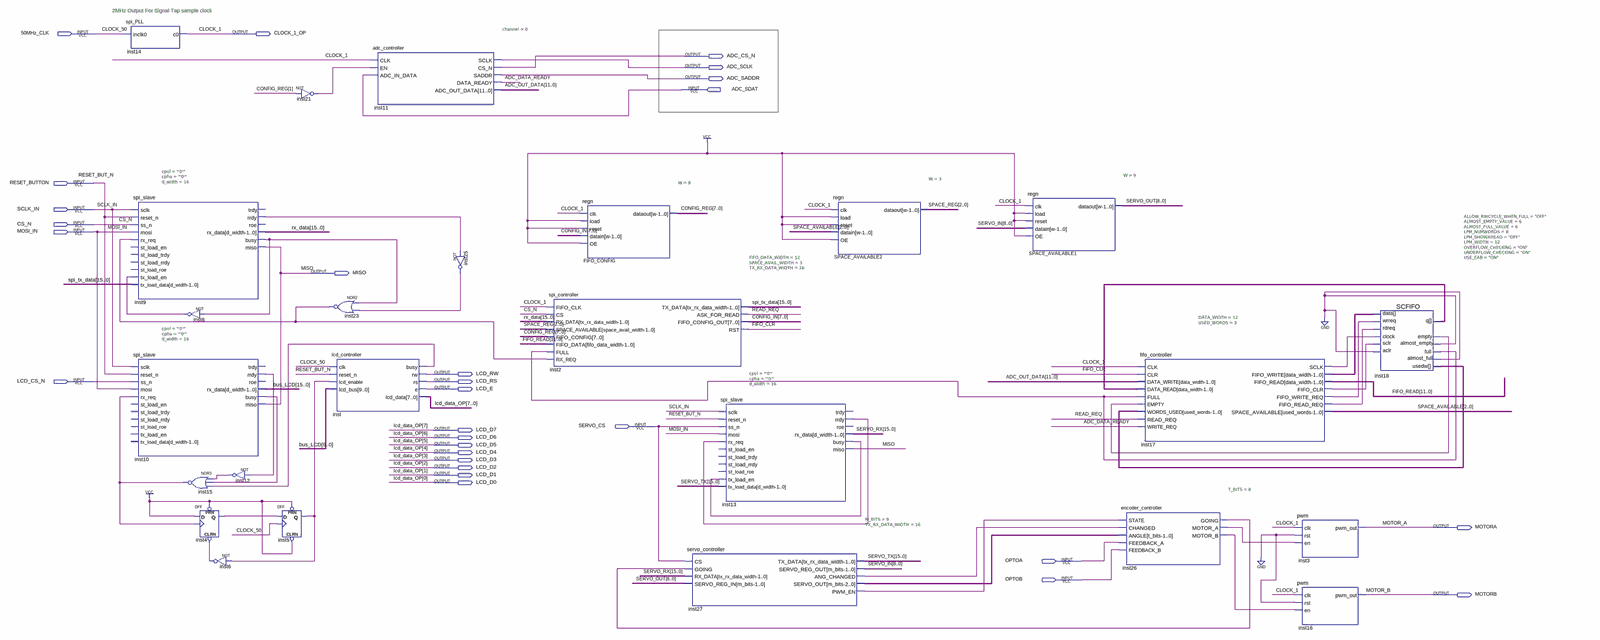
[diagram p0: schematic sheet, whole]
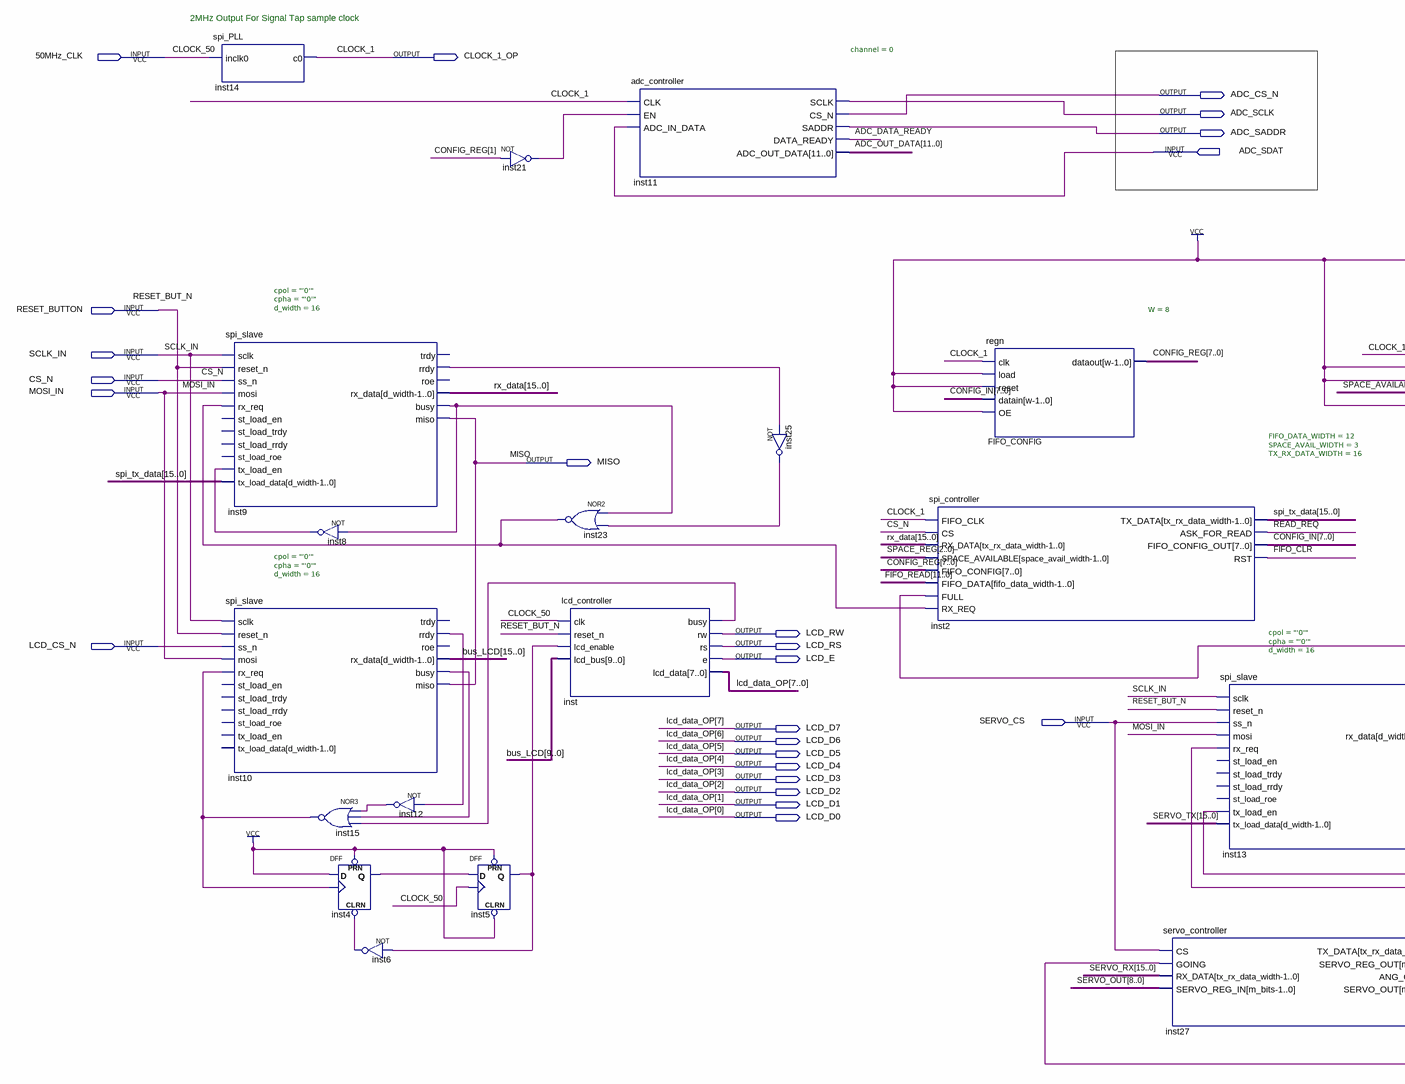
[diagram p1: schematic sheet, left part]
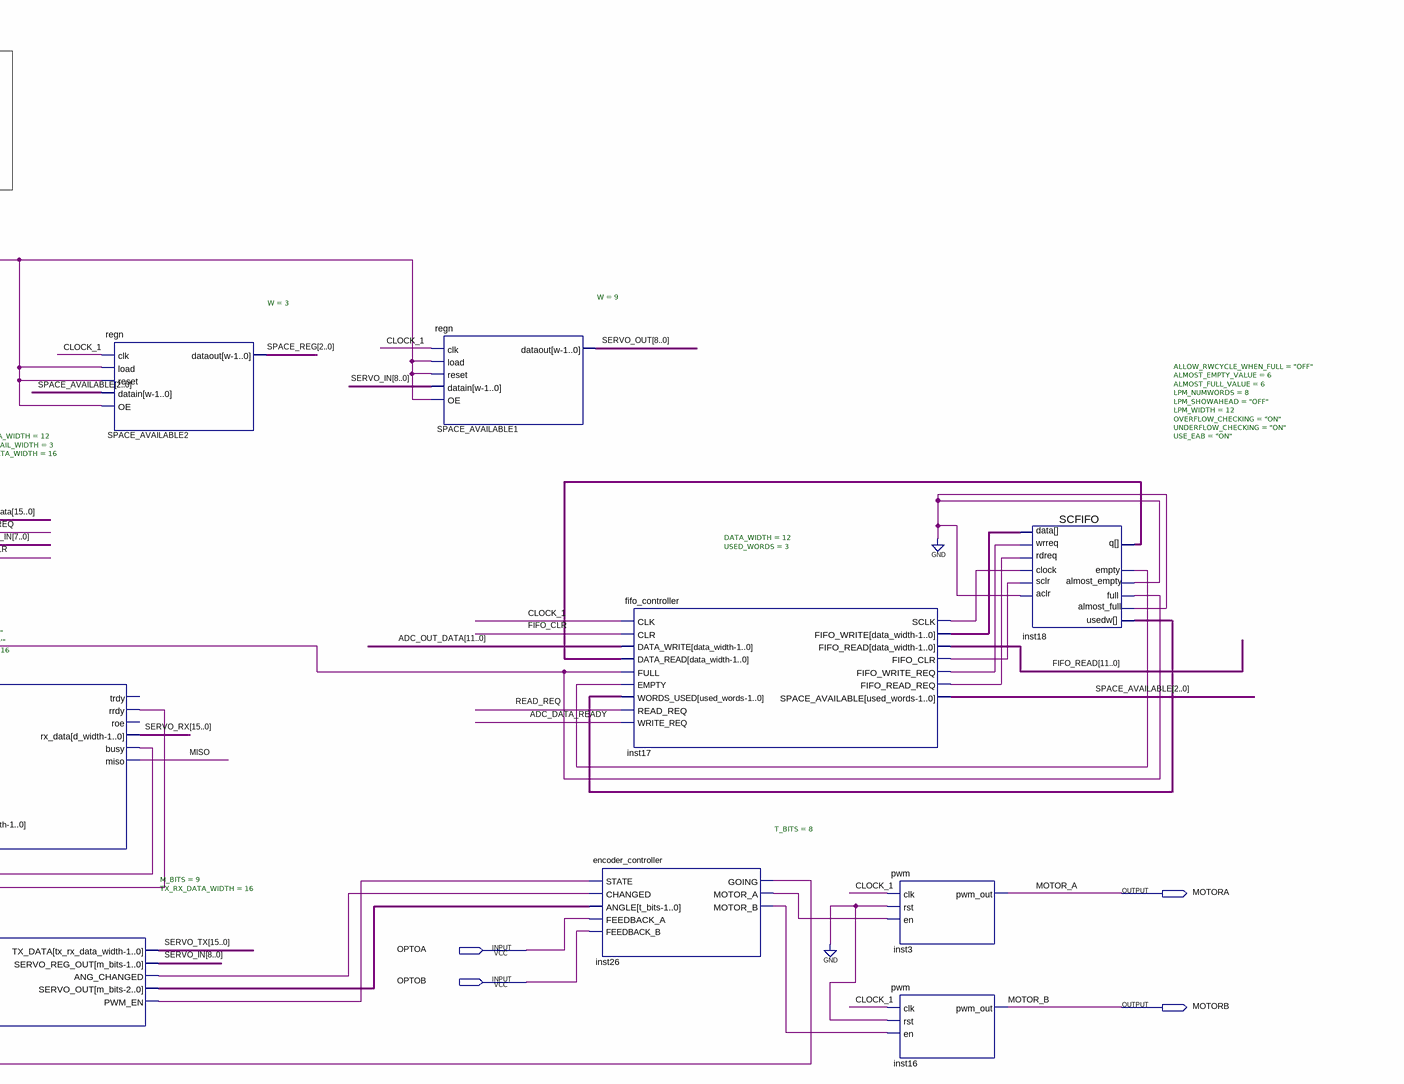
[diagram p2: schematic sheet, right part]
// Quartus schematic spi_test.bdf as structural Verilog: 25 symbols, 28 pins
module spi_test (
  input  \50MHz_CLK ,
  input  ADC_SDAT,
  input  RESET_BUTTON,
  input  SCLK_IN,
  input  CS_N,
  input  MOSI_IN,
  input  LCD_CS_N,
  input  SERVO_CS,
  input  OPTOA,
  input  OPTOB,
  output CLOCK_1_OP,
  output ADC_CS_N,
  output ADC_SCLK,
  output ADC_SADDR,
  output MISO,
  output LCD_RW,
  output LCD_RS,
  output LCD_E,
  output LCD_D7,
  output LCD_D6,
  output LCD_D5,
  output LCD_D4,
  output LCD_D3,
  output LCD_D2,
  output LCD_D1,
  output LCD_D0,
  output MOTORA,
  output MOTORB
);

  wire ADC_DATA_READY, FIFO_CLR, inst4_q, inst5_q, inst6_out, inst8_out, inst9_busy, inst9_rrdy, inst10_busy,
       inst10_rrdy, inst12_out, inst13_busy, inst13_rrdy, inst15_out, inst17_fifo_clr, inst17_fifo_read_req,
       inst17_fifo_write_req, inst17_sclk, inst18_almost_empty, inst18_empty, inst18_full, inst21_out,
       inst23_out, inst25_out, inst26_going, inst26_motor_a, inst26_motor_b, inst27_ang_changed,
       inst27_pwm_en, inst_busy, READ_REQ;
  wire [2:0] inst18_usedw, SPACE_AVAILABLE, SPACE_REG;
  wire [7:0] CONFIG_IN, CONFIG_REG, inst27_servo_out;
  wire [8:0] SERVO_IN, SERVO_OUT;
  wire [11:0] ADC_OUT_DATA, FIFO_READ, inst17_fifo_write, inst18_q;
  wire [15:0] bus_LCD, rx_data, SERVO_RX, SERVO_TX, spi_tx_data;

  spi_PLL inst14 (.inclk0(\50MHz_CLK ), .c0(CLOCK_1_OP));
  spi_slave #(.cpol("'0'"), .cpha("'0'"), .d_width(16)) inst9 (
    .sclk(SCLK_IN), .reset_n(RESET_BUTTON), .ss_n(CS_N), .mosi(MOSI_IN), .rx_req(inst23_out),
    .tx_load_en(inst8_out), .tx_load_data(spi_tx_data), .rrdy(inst9_rrdy), .rx_data(rx_data),
    .busy(inst9_busy), .miso(MISO));  // open: st_load_en, st_load_trdy, st_load_rrdy, st_load_roe, trdy, roe
  spi_slave #(.cpol("'0'"), .cpha("'0'"), .d_width(16)) inst10 (
    .sclk(SCLK_IN), .reset_n(RESET_BUTTON), .ss_n(LCD_CS_N), .mosi(MOSI_IN), .rx_req(inst15_out),
    .rrdy(inst10_rrdy), .rx_data(bus_LCD), .busy(inst10_busy), .miso(MISO));  // open: st_load_en, st_load_trdy, st_load_rrdy, st_load_roe, tx_load_en, tx_load_data, trdy, roe
  not inst8 (inst8_out, inst9_busy);
  nor inst15 (inst15_out, inst12_out, inst10_busy, inst_busy);
  DFF inst4 (.CLRN(inst6_out), .CLK(inst15_out), .D(1'b1), .PRN(1'b1), .Q(inst4_q));
  not inst6 (inst6_out, inst5_q);
  not inst12 (inst12_out, inst10_rrdy);
  DFF inst5 (.CLRN(1'b1), .CLK(\50MHz_CLK ), .D(inst4_q), .PRN(1'b1), .Q(inst5_q));
  not inst21 (inst21_out, CONFIG_REG[1]);
  nor inst23 (inst23_out, inst9_busy, inst25_out);
  lcd_controller inst (
    .clk(\50MHz_CLK ), .reset_n(RESET_BUTTON), .lcd_enable(inst5_q), .lcd_bus(bus_LCD[9:0]),
    .busy(inst_busy), .rw(LCD_RW), .rs(LCD_RS), .e(LCD_E),
    .lcd_data({LCD_D7, LCD_D6, LCD_D5, LCD_D4, LCD_D3, LCD_D2, LCD_D1, LCD_D0}));
  adc_controller #(.channel(0)) inst11 (
    .CLK(CLOCK_1_OP), .EN(inst21_out), .ADC_IN_DATA(ADC_SDAT), .SCLK(ADC_SCLK), .CS_N(ADC_CS_N),
    .SADDR(ADC_SADDR), .DATA_READY(ADC_DATA_READY), .ADC_OUT_DATA(ADC_OUT_DATA));
  not inst25 (inst25_out, inst9_rrdy);
  spi_controller #(.FIFO_DATA_WIDTH(12), .SPACE_AVAIL_WIDTH(3), .TX_RX_DATA_WIDTH(16)) inst2 (
    .FIFO_CLK(CLOCK_1_OP), .CS(CS_N), .RX_DATA(rx_data), .SPACE_AVAILABLE(SPACE_REG),
    .FIFO_CONFIG(CONFIG_REG), .FIFO_DATA(FIFO_READ), .FULL(inst18_full), .RX_REQ(inst23_out),
    .TX_DATA(spi_tx_data), .ASK_FOR_READ(READ_REQ), .FIFO_CONFIG_OUT(CONFIG_IN), .RST(FIFO_CLR));
  regn #(.W(8)) FIFO_CONFIG (
    .clk(CLOCK_1_OP), .load(1'b1), .reset(1'b1), .datain(CONFIG_IN), .OE(1'b1), .dataout(CONFIG_REG));
  servo_controller #(.M_BITS(9), .TX_RX_DATA_WIDTH(16)) inst27 (
    .CS(SERVO_CS), .GOING(inst26_going), .RX_DATA(SERVO_RX), .SERVO_REG_IN(SERVO_OUT), .TX_DATA(SERVO_TX),
    .SERVO_REG_OUT(SERVO_IN), .ANG_CHANGED(inst27_ang_changed), .SERVO_OUT(inst27_servo_out),
    .PWM_EN(inst27_pwm_en));
  spi_slave #(.cpol("'0'"), .cpha("'0'"), .d_width(16)) inst13 (
    .sclk(SCLK_IN), .reset_n(RESET_BUTTON), .ss_n(SERVO_CS), .mosi(MOSI_IN), .rx_req(inst13_rrdy),
    .tx_load_en(inst13_busy), .tx_load_data(SERVO_TX), .rrdy(inst13_rrdy), .rx_data(SERVO_RX),
    .busy(inst13_busy), .miso(MISO));  // open: st_load_en, st_load_trdy, st_load_rrdy, st_load_roe, trdy, roe
  regn #(.W(3)) SPACE_AVAILABLE2 (
    .clk(CLOCK_1_OP), .load(1'b1), .reset(1'b1), .datain(SPACE_AVAILABLE), .OE(1'b1), .dataout(SPACE_REG));
  regn #(.W(9)) SPACE_AVAILABLE1 (
    .clk(CLOCK_1_OP), .load(1'b1), .reset(1'b1), .datain(SERVO_IN), .OE(1'b1), .dataout(SERVO_OUT));
  fifo_controller #(.DATA_WIDTH(12), .USED_WORDS(3)) inst17 (
    .CLK(CLOCK_1_OP), .CLR(FIFO_CLR), .DATA_WRITE(ADC_OUT_DATA), .DATA_READ(inst18_q), .FULL(inst18_full),
    .EMPTY(inst18_empty), .WORDS_USED(inst18_usedw), .READ_REQ(READ_REQ), .WRITE_REQ(ADC_DATA_READY),
    .SCLK(inst17_sclk), .FIFO_WRITE(inst17_fifo_write), .FIFO_READ(FIFO_READ), .FIFO_CLR(inst17_fifo_clr),
    .FIFO_WRITE_REQ(inst17_fifo_write_req), .FIFO_READ_REQ(inst17_fifo_read_req),
    .SPACE_AVAILABLE(SPACE_AVAILABLE));
  encoder_controller #(.T_BITS(8)) inst26 (
    .STATE(inst27_pwm_en), .CHANGED(inst27_ang_changed), .ANGLE(inst27_servo_out), .FEEDBACK_A(OPTOA),
    .FEEDBACK_B(OPTOB), .GOING(inst26_going), .MOTOR_A(inst26_motor_a), .MOTOR_B(inst26_motor_b));
  pwm inst3 (.clk(CLOCK_1_OP), .rst(1'b0), .en(inst26_motor_a), .pwm_out(MOTORA));
  pwm inst16 (.clk(CLOCK_1_OP), .rst(1'b0), .en(inst26_motor_b), .pwm_out(MOTORB));
  SCFIFO #(.ALLOW_RWCYCLE_WHEN_FULL("OFF"), .ALMOST_EMPTY_VALUE(6), .ALMOST_FULL_VALUE(6), .LPM_NUMWORDS(8), .LPM_SHOWAHEAD("OFF"), .LPM_WIDTH(12), .OVERFLOW_CHECKING("ON"), .UNDERFLOW_CHECKING("ON"), .USE_EAB("ON")) inst18 (
    .clock(inst17_sclk), .data(inst17_fifo_write), .wrreq(inst17_fifo_write_req),
    .rdreq(inst17_fifo_read_req), .aclr(inst18_almost_empty), .sclr(inst17_fifo_clr), .q(inst18_q),
    .empty(inst18_empty), .full(inst18_full), .almost_empty(inst18_almost_empty), .usedw(inst18_usedw),
    .almost_full(inst18_almost_empty));
  // also tied to GND on the sheet: inst18_almost_empty

  // Other names for the same wires on the sheet: CLOCK_1 = CLOCK_1_OP; CLOCK_50 = \50MHz_CLK ;
  //   lcd_data_OP[7:0] = {LCD_D7, LCD_D6, LCD_D5, LCD_D4, LCD_D3, LCD_D2, LCD_D1, LCD_D0}; MOTOR_A = MOTORA;
  //   MOTOR_B = MOTORB; RESET_BUT_N = RESET_BUTTON

  // Notes on the sheet:
  //   2MHz Output For Signal Tap sample clock
endmodule
